# EAGLE design Decade Counter (EAGLE 6.5.0)
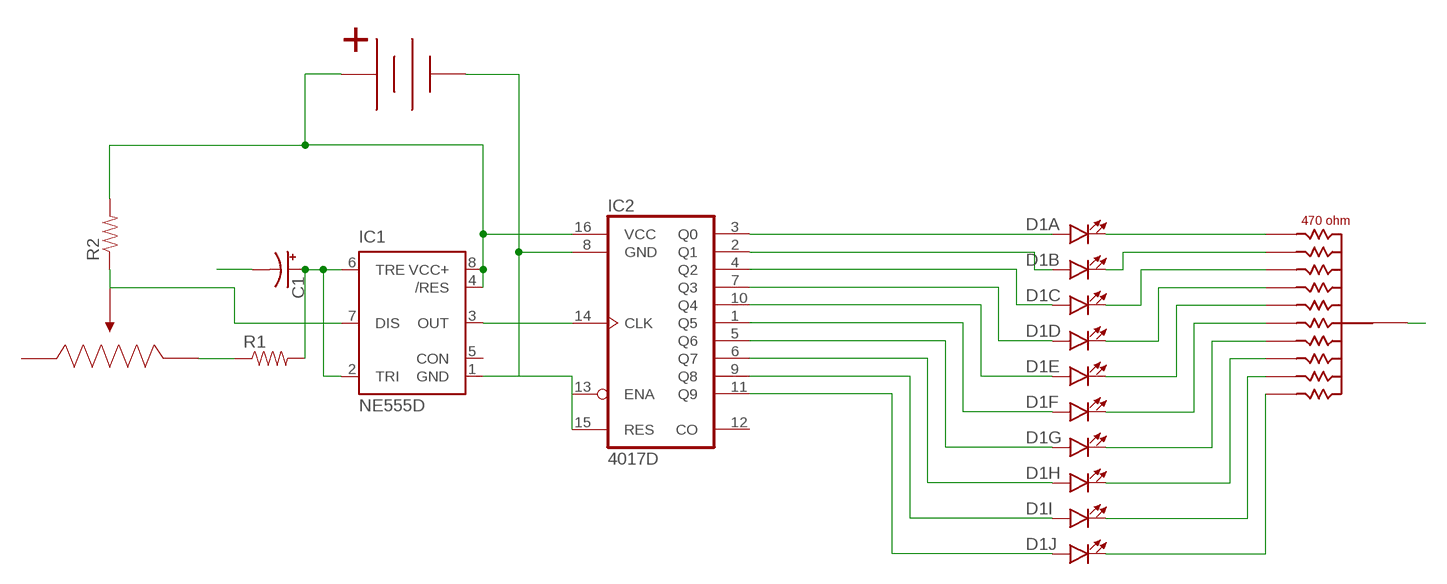
[diagram p0: schematic, sheet 1]

## Parts
470OHM  470 ohm  11PI_RESISTOR_COMMON  [11-PIN-RESISTOR]
C1  CAP_POLPTH1  [CPOL-RADIAL-100UF-25V]
D1  LED_BARGRAPH_10  [LED_BARGAPH_10]
IC1  NE555D  [SO08]
IC2  4017D  [SO16]
R1  RESISTOR0805-RES  [0805]
R2  RESISTOR0805-RES  [0805]
U$1  VERTICAL_TRIM_POT  [TRIM-POT-VERTICLE]
U$2  COIN-BATTERY-12MM-BOTTOM  [BATTCON_12MM_BOTTOM]

## Nets
GND: 470OHM.COMMON C1.2(-) IC1.1(GND) IC2.8(GND) IC2.13(ENA) IC2.15(RES) U$2.GND
N$1: 470OHM.1 D1.20(A:C)
N$2: 470OHM.2 D1.19(B:C)
N$3: 470OHM.3 D1.18(C:C)
N$4: 470OHM.4 D1.17(D:C)
N$5: 470OHM.5 D1.16(E:C)
N$6: 470OHM.6 D1.15(F:C)
N$7: 470OHM.7 D1.14(G:C)
N$8: 470OHM.8 D1.13(H:C)
N$9: 470OHM.9 D1.12(I:C)
N$10: 470OHM.10 D1.11(J:C)
N$11: D1.1(A:A) IC2.3(Q0)
N$12: D1.2(B:A) IC2.2(Q1)
N$13: D1.3(C:A) IC2.4(Q2)
N$14: D1.4(D:A) IC2.7(Q3)
N$15: D1.5(E:A) IC2.10(Q4)
N$16: D1.6(F:A) IC2.1(Q5)
N$17: D1.7(G:A) IC2.5(Q6)
N$18: D1.8(H:A) IC2.6(Q7)
N$19: D1.9(I:A) IC2.9(Q8)
N$20: D1.10(J:A) IC2.11(Q9)
N$21: IC1.3(OUT) IC2.14(CLK)
N$22: R1.1 U$1.3
N$25: IC1.7(DIS) R2.1 U$1.WIPER2(WIPER)
N$26: C1.1(+) IC1.2(TRI) IC1.6(TRE) R1.2
VCC: IC1.4(/RES) IC1.8(VCC+) IC2.16(VCC) R2.2 U$2.PWR@1(PWR) U$2.PWR@2(PWR)
Unconnected: IC1.5(CON) IC2.12(CO) U$1.1

## Library data of the parts
470OHM = NU STEM:11PI_RESISTOR_COMMON
C1 = SparkFun-Passives:CAP_POL: Capacitor Polarized These are standard SMD and PTH capacitors. Normally 10uF, 47uF, and 100uF in electrolytic and tantalum varieties. Always verify the external diameter of the through hole cap, it varies with capacity, voltage, and manufacturer. The EIA devices should be standard.
D1 = SparkFun-LED:LED_BARGRAPH_10: 10-Segment LED Bar Graph SFE part numbers: COM-09935 (red, Vf = 2.1V, Ifmax = 20mA) COM-09936 (yellow, Vf = 2.1V, Ifmax = 20mA) COM-09937 (blue, Vf = 3.4V, Ifmax = 20mA) COM-09938 (green, Vf = 3.4V, Ifmax = 20mA)
IC1 = SparkFun-AnalogIC:NE555: General purpose bipolar Timer
IC2 = NU STEM:4017: COUNTER/DIVIDER
R1 R2 = SparkFun-Resistors:RESISTOR: Resistor Basic schematic elements and footprints for 0603, 1206, and PTH resistors.
U$1 = NU STEM:VERTICAL_TRIM_POT
U$2 = NU STEM:COIN-BATTERY-12MM-BOTTOM

## Board
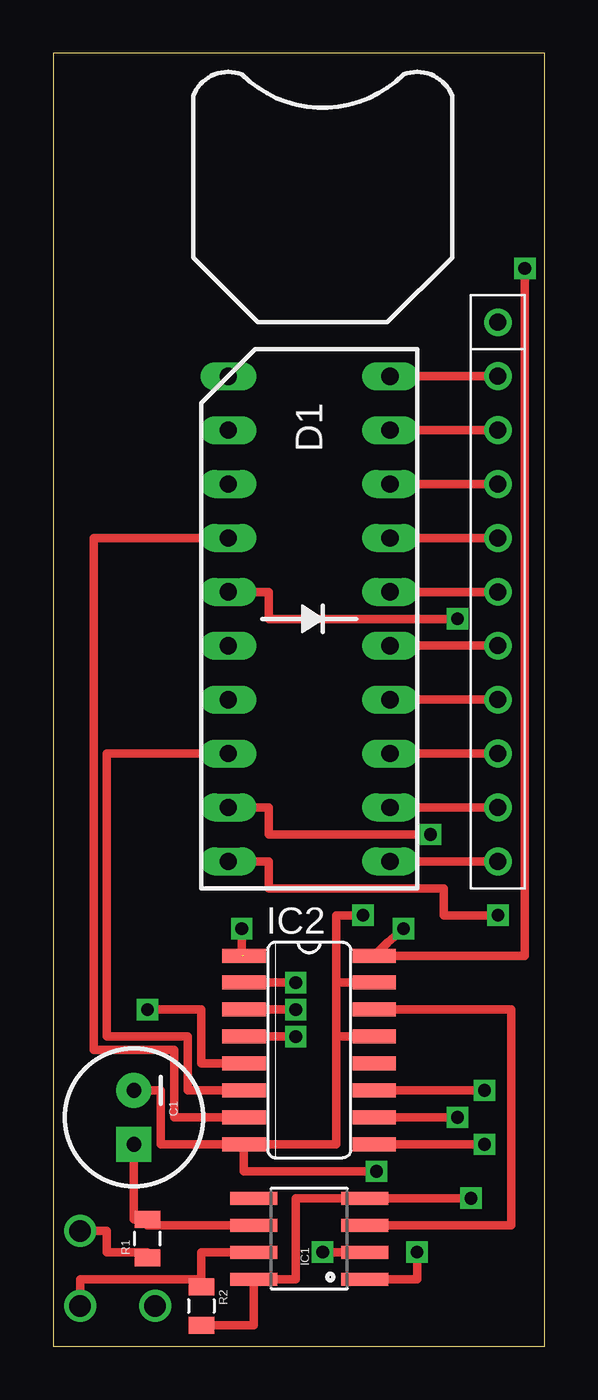
[diagram p1: board, top side]
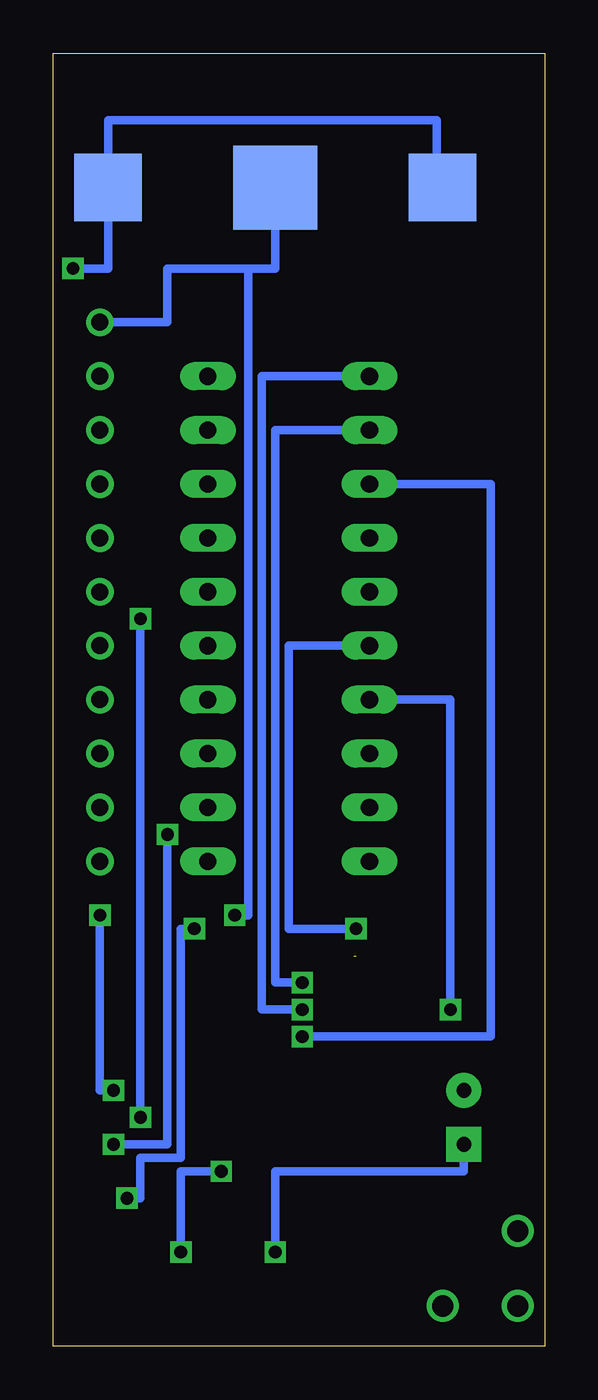
[diagram p2: board, bottom side, seen from below]

Size 23.16 x 60.95 mm. Coordinates in mm from the lower left corner, seen from the top.
Outline: 0,0 23.16,0 23.16,60.95 0,60.95 0,0
Copper layers (1*16): Top 0.035mm / dielectric 1.5mm / Bottom 0.035mm
Design rules "default *": minimum track width 10mil, minimum drill 13mil, track to track 7mil, track to pad 8mil, pad to pad 8mil, via to via 8mil, smd to smd 8mil, copper to edge 40mil, drill to drill 8mil, minimum pad ring 10mil, minimum via ring 8mil, stop-mask expansion 4mil, vias tented up to drill 0mil, thermal gap 10mil

### Footprints (pad centres in the part's own frame; a part is rotated, then mirrored left to right if it is on the bottom)
11-PIN-RESISTOR = drill 0.8: 1 -10.16,0; 2 -7.62,0; 3 -5.08,0; 4 -2.54,0; 5 0,0; 6 2.54,0; 7 5.08,0; 8 7.62,0; 9 10.16,0; 10 12.7,0; COMMON -12.7,0
CPOL-RADIAL-100UF-25V = drill 0.7 pad 1.651 square: 1 1.27,0 | drill 0.7 pad 1.651: 2 -1.27,0
LED_BARGAPH_10 = drill 0.813 long: 1 -11.43,-3.81; 2 -8.89,-3.81; 3 -6.35,-3.81; 4 -3.81,-3.81; 5 -1.27,-3.81; 6 1.27,-3.81; 7 3.81,-3.81; 8 6.35,-3.81; 9 8.89,-3.81; 10 11.43,-3.81; 11 11.43,3.81; 12 8.89,3.81; 13 6.35,3.81; 14 3.81,3.81; 15 1.27,3.81; 16 -1.27,3.81; 17 -3.81,3.81; 18 -6.35,3.81; 19 -8.89,3.81; 20 -11.43,3.81
SO08 = smd 0.61 x 2.21: 1 -1.905,-2.616; 2 -0.635,-2.616; 3 0.635,-2.616; 4 1.905,-2.616; 5 1.905,2.616; 6 0.635,2.616; 7 -0.635,2.616; 8 -1.905,2.616
SO16 = smd 0.66 x 2.032: 1 -4.445,-3.073; 2 -3.175,-3.073; 3 -1.905,-3.073; 4 -0.635,-3.073; 5 0.635,-3.073; 6 1.905,-3.073; 7 3.175,-3.073; 8 4.445,-3.073; 9 4.445,3.073; 10 3.175,3.073; 11 1.905,3.073; 12 0.635,3.073; 13 -0.635,3.073; 14 -1.905,3.073; 15 -3.175,3.073; 16 -4.445,3.073
0805 = smd 0.8 x 1.2: 1 -0.9,0; 2 0.9,0
TRIM-POT-VERTICLE = drill 1: 1 -2.5,-2.5; 3 2.5,-2.5; WIPER2 0,0
BATTCON_12MM_BOTTOM = smd 3.962 x 3.962 bottom: GND 0,0 | smd 3.175 x 3.175 bottom: PWR@1 -7.874,0; PWR@2 7.874,0

### Placement (x,y rotation side)
470OHM  20.95,35.56 270 top
C1  3.81,10.79 270 top
D1  12.06,34.29 270 top
IC1  12.06,5.08 90 top
IC2  12.06,13.97 270 top
R1  4.45,5.08 90 top
R2  6.99,1.91 270 top
U$1  1.27,1.91 135 top
U$2  12.7,54.61 0 top

### Tracks (layer width: path | path; a pad name or v marks a point on that pad's centre or on a via)
GND  (via drill 0.6)
  Top 0.406: IC1.1 17.14,3.17 v17.14,4.45 | v15.24,8.26 8.99,8.26 IC2.8 | IC2.8 5.08,9.53 5.08,12.06 C1.2 | IC2.8 13.34,9.53 13.34,14.61 | IC2.13 13.34,14.61 | 13.34,14.61 13.34,17.14 | IC2.15 13.34,17.14 | 13.34,17.14 13.34,20.32 v14.61,20.32
  Bottom 0.406: v17.14,4.45 17.14,8.26 v15.24,8.26 | v14.61,20.32 13.97,20.32 13.97,50.8 | 13.97,50.8 12.7,50.8 U$2.GND | 13.97,50.8 17.78,50.8 17.78,48.26 470OHM.COMMON
N$1
  Top 0.406: D1.20 470OHM.1
N$2
  Top 0.406: D1.19 470OHM.2
N$3
  Top 0.406: D1.18 470OHM.3
N$4
  Top 0.406: D1.17 470OHM.4
N$5
  Top 0.406: D1.16 470OHM.5
N$6
  Top 0.406: D1.15 470OHM.6
N$7
  Top 0.406: D1.14 470OHM.7
N$8
  Top 0.406: D1.13 470OHM.8
N$9
  Top 0.406: D1.12 470OHM.9
N$10
  Top 0.406: D1.11 470OHM.10
N$11  (via drill 0.6)
  Top 0.406: IC2.3 v11.43,15.88
  Bottom 0.406: v11.43,15.88 13.34,15.88 13.34,45.72 D1.1
N$12  (via drill 0.6)
  Top 0.406: IC2.2 v11.43,17.14
  Bottom 0.406: v11.43,17.14 12.7,17.14 12.7,43.18 D1.2
N$13  (via drill 0.6)
  Top 0.406: IC2.4 v11.43,14.61
  Bottom 0.406: v11.43,14.61 2.54,14.61 2.54,40.64 D1.3
N$14
  Top 0.406: D1.4 1.91,38.1 1.91,13.97 5.71,13.97 5.71,10.79 IC2.7
N$15  (via drill 0.6)
  Top 0.406: v19.05,34.29 10.16,34.29 10.16,35.56 D1.5 | IC2.10 v19.05,10.79
  Bottom 0.406: v19.05,10.79 v19.05,34.29
N$16  (via drill 0.6)  (1 unrouted)
  Top 0.406: 8.89,18.41 v8.89,19.68
  Bottom 0.406: v8.89,19.68 12.06,19.68 12.06,33.02 D1.6
N$17  (via drill 0.6)
  Top 0.406: v4.45,15.88 6.99,15.88 6.99,13.34 IC2.5
  Bottom 0.406: v4.45,15.88 4.45,30.48 D1.7
N$18
  Top 0.406: D1.8 2.54,27.94 2.54,14.61 6.35,14.61 6.35,12.06 IC2.6
N$19  (via drill 0.6)
  Top 0.406: v17.78,24.13 10.16,24.13 10.16,25.4 D1.9 | IC2.9 v20.32,9.53
  Bottom 0.406: v20.32,9.53 17.78,9.53 v17.78,24.13
N$20  (via drill 0.6)
  Top 0.406: v20.95,20.32 18.41,20.32 18.41,21.59 10.16,21.59 10.16,22.86 D1.10 | IC2.11 v20.32,12.06
  Bottom 0.406: v20.32,12.06 20.95,12.06 v20.95,20.32
N$21
  Top 0.406: IC1.3 21.59,5.71 21.59,15.88 IC2.14
N$22
  Top 0.406: U$1.3 2.54,5.44 2.54,4.45 4.45,4.45 R1.1
N$25
  Top 0.406: IC1.7 6.99,4.45 R2.1 6.99,3.17 1.27,3.17 U$1.WIPER2
N$26  (via drill 0.6)
  Top 0.406: 9.53,5.71 IC1.6 4.45,5.71 R1.2 3.81,5.98 C1.1 | IC1.2 v12.7,4.45
  Bottom 0.406: v12.7,4.45 12.7,8.26 3.81,8.26 C1.1
VCC  (via drill 0.6)
  Top 0.406: 9.79,3.17 IC1.8 | IC1.8 11.43,3.17 11.43,6.99 IC1.4 v19.68,6.99 | R2.2 9.45,1 IC1.8 | v16.51,19.68 15.77,19.05 IC2.16 22.23,18.41 v22.23,50.8
  Bottom 0.406: v19.68,6.99 19.05,6.99 19.05,8.89 17.14,8.89 17.14,19.68 v16.51,19.68 | U$2.PWR@1 5.08,54.61 5.08,57.78 20.57,57.78 U$2.PWR@2 20.57,50.8 v22.23,50.8